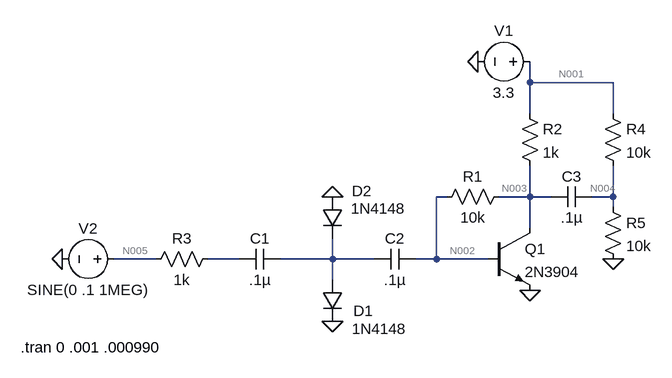
[diagram p0: schematic Draft3.asc]
Draft3.asc, the LTspice schematic file:
Version 4
SHEET 1 880 680
WIRE 224 -112 224 -144
WIRE 352 -112 224 -112
WIRE 224 -64 224 -112
WIRE 352 -64 352 -112
WIRE 96 64 80 64
WIRE 224 64 224 16
WIRE 224 64 176 64
WIRE 256 64 224 64
WIRE 352 64 352 16
WIRE 352 64 320 64
WIRE 352 80 352 64
WIRE 224 112 224 64
WIRE -352 160 -416 160
WIRE -224 160 -272 160
WIRE -80 160 -80 128
WIRE -80 160 -160 160
WIRE -16 160 -80 160
WIRE 80 160 80 64
WIRE 80 160 48 160
WIRE 160 160 80 160
WIRE -80 192 -80 160
FLAG 224 208 0
FLAG 144 -144 0
FLAG -496 160 0
FLAG -80 256 0
FLAG -80 64 0
FLAG 352 160 0
SYMBOL npn 160 112 R0
SYMATTR InstName Q1
SYMATTR Value 2N3904
SYMBOL res 192 48 R90
WINDOW 0 0 56 VBottom 2
WINDOW 3 32 56 VTop 2
SYMATTR InstName R1
SYMATTR Value 10k
SYMBOL res 208 -80 R0
SYMATTR InstName R2
SYMATTR Value 1k
SYMBOL voltage 240 -144 R90
WINDOW 0 -32 56 VBottom 2
WINDOW 3 32 56 VTop 2
WINDOW 123 0 0 Left 0
WINDOW 39 0 0 Left 0
SYMATTR InstName V1
SYMATTR Value 3.3
SYMBOL res -256 144 R90
WINDOW 0 0 56 VBottom 2
WINDOW 3 32 56 VTop 2
SYMATTR InstName R3
SYMATTR Value 1k
SYMBOL voltage -400 160 R90
WINDOW 0 -32 56 VBottom 2
WINDOW 3 32 56 VTop 2
WINDOW 123 0 0 Left 0
WINDOW 39 0 0 Left 0
SYMATTR InstName V2
SYMATTR Value SINE(0 .1 1MEG)
SYMBOL cap -160 144 R90
WINDOW 0 0 32 VBottom 2
WINDOW 3 32 32 VTop 2
SYMATTR InstName C1
SYMATTR Value .1µ
SYMBOL cap 48 144 R90
WINDOW 0 0 32 VBottom 2
WINDOW 3 32 32 VTop 2
SYMATTR InstName C2
SYMATTR Value .1µ
SYMBOL diode -96 192 R0
WINDOW 0 48 48 Left 2
WINDOW 3 46 75 Left 2
SYMATTR InstName D1
SYMATTR Value 1N4148
SYMBOL diode -96 64 R0
WINDOW 0 46 -9 Left 2
WINDOW 3 44 18 Left 2
SYMATTR InstName D2
SYMATTR Value 1N4148
SYMBOL res 336 -80 R0
SYMATTR InstName R4
SYMATTR Value 10k
SYMBOL res 336 64 R0
SYMATTR InstName R5
SYMATTR Value 10k
SYMBOL cap 320 48 R90
WINDOW 0 0 32 VBottom 2
WINDOW 3 32 32 VTop 2
SYMATTR InstName C3
SYMATTR Value .1µ
TEXT -560 296 Left 2 !.tran 0 .001 .000990

The netlist it stands for:
* Draft3.asc
Q1 N003 N002 0 0 2N3904
R1 N003 N002 10k
R2 N001 N003 1k
V1 N001 0 3.3
R3 N006 N005 1k
V2 N005 0 SINE(0 .1 1MEG)
C1 N007 N006 .1µ
C2 N002 N007 .1µ
D1 N007 0 1N4148
D2 0 N007 1N4148
R4 N001 N004 10k
R5 N004 0 10k
C3 N004 N003 .1µ
.model D D
.lib standard.dio
.model NPN NPN
.model PNP PNP
.lib standard.bjt
.tran 0 .001 .000990
.backanno
.end

* Results of the author's LTspice run, read from the files saved beside the schematic
* Operating Point, zero values left out:
*   V(n003) = 764.4 mV
*   V(n002) = 679.7 mV
*   V(n001) = 3.3 V
*   V(n004) = 1.65 V
*   Ic(Q1) = 2.527 mA
*   Ib(Q1) = 8.47 µA
*   Ie(Q1) = -2.536 mA
*   I(R5) = 165 µA
*   I(R4) = 165 µA
*   I(R2) = 2.536 mA
*   I(R1) = 8.47 µA
*   I(V1) = -2.701 mA
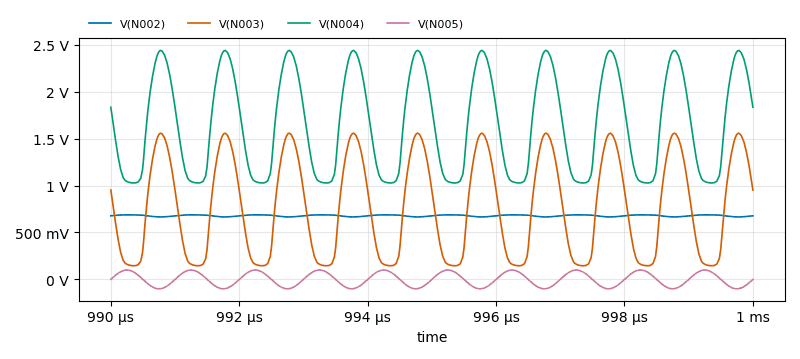
[diagram p1: Transient Analysis of Draft3.asc, plotted from the saved traces]
* Transient Analysis, 1 run:
*   V(N002): min 665.6 mV, max 687.8 mV, average 678.5 mV, rms 678.6 mV, last 677.5 mV
*   V(N003): min 145.3 mV, max 1.558 V, average 768.5 mV, rms 938 mV, last 952.4 mV
*   V(N004): min 1.027 V, max 2.44 V, average 1.65 V, rms 1.736 V, last 1.834 V
*   V(N005): min -99.98 mV, max 99.95 mV, average -12.71 µV, rms 70.75 mV, last 0 V